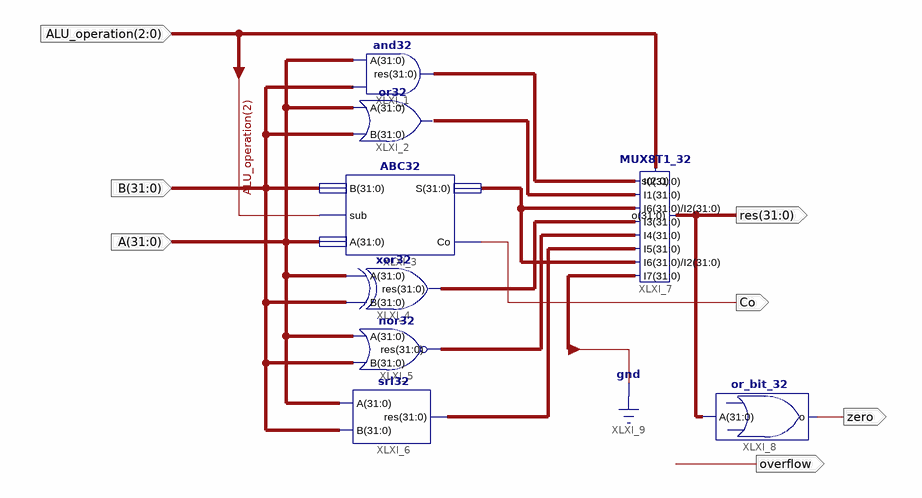
[diagram p0: schematic sheet 1]
// Xilinx ISE schematic alu.sch (kintex7) as structural Verilog: 8 symbols, 7 ports
module alu (
  input  [31:0] A,
  input  [31:0] B,
  input  [2:0] ALU_operation,
  output Co,
  output [31:0] res,
  output zero,
  output overflow
);

  wire [31:0] S, XLXN_6, XLXN_9, XLXN_10, XLXN_11, XLXN_20;

  and32 XLXI_1 (.res(XLXN_6), .A(A), .B(B));
  or32 XLXI_2 (.res(XLXN_20), .A(A), .B(B));
  ABC32 XLXI_3 (.B(B), .sub(ALU_operation[2]), .A(A), .S(S), .Co(Co));
  xor32 XLXI_4 (.A(A), .B(B), .res(XLXN_9));
  nor32 XLXI_5 (.res(XLXN_10), .A(A), .B(B));
  srl32 XLXI_6 (.A(A), .B(B), .res(XLXN_11));
  MUX8T1_32 XLXI_7 (
    .s(ALU_operation), .I7({{31{1'b0}}, S[31]}), .I6(S), .I5(XLXN_11), .I4(XLXN_10), .I3(XLXN_9), .I2(S),
    .I1(XLXN_20), .I0(XLXN_6), .o(res));
  or_bit_32 XLXI_8 (.o(zero), .A(res));
endmodule
